# Altium schematic sheet P2.SchDoc
size A4
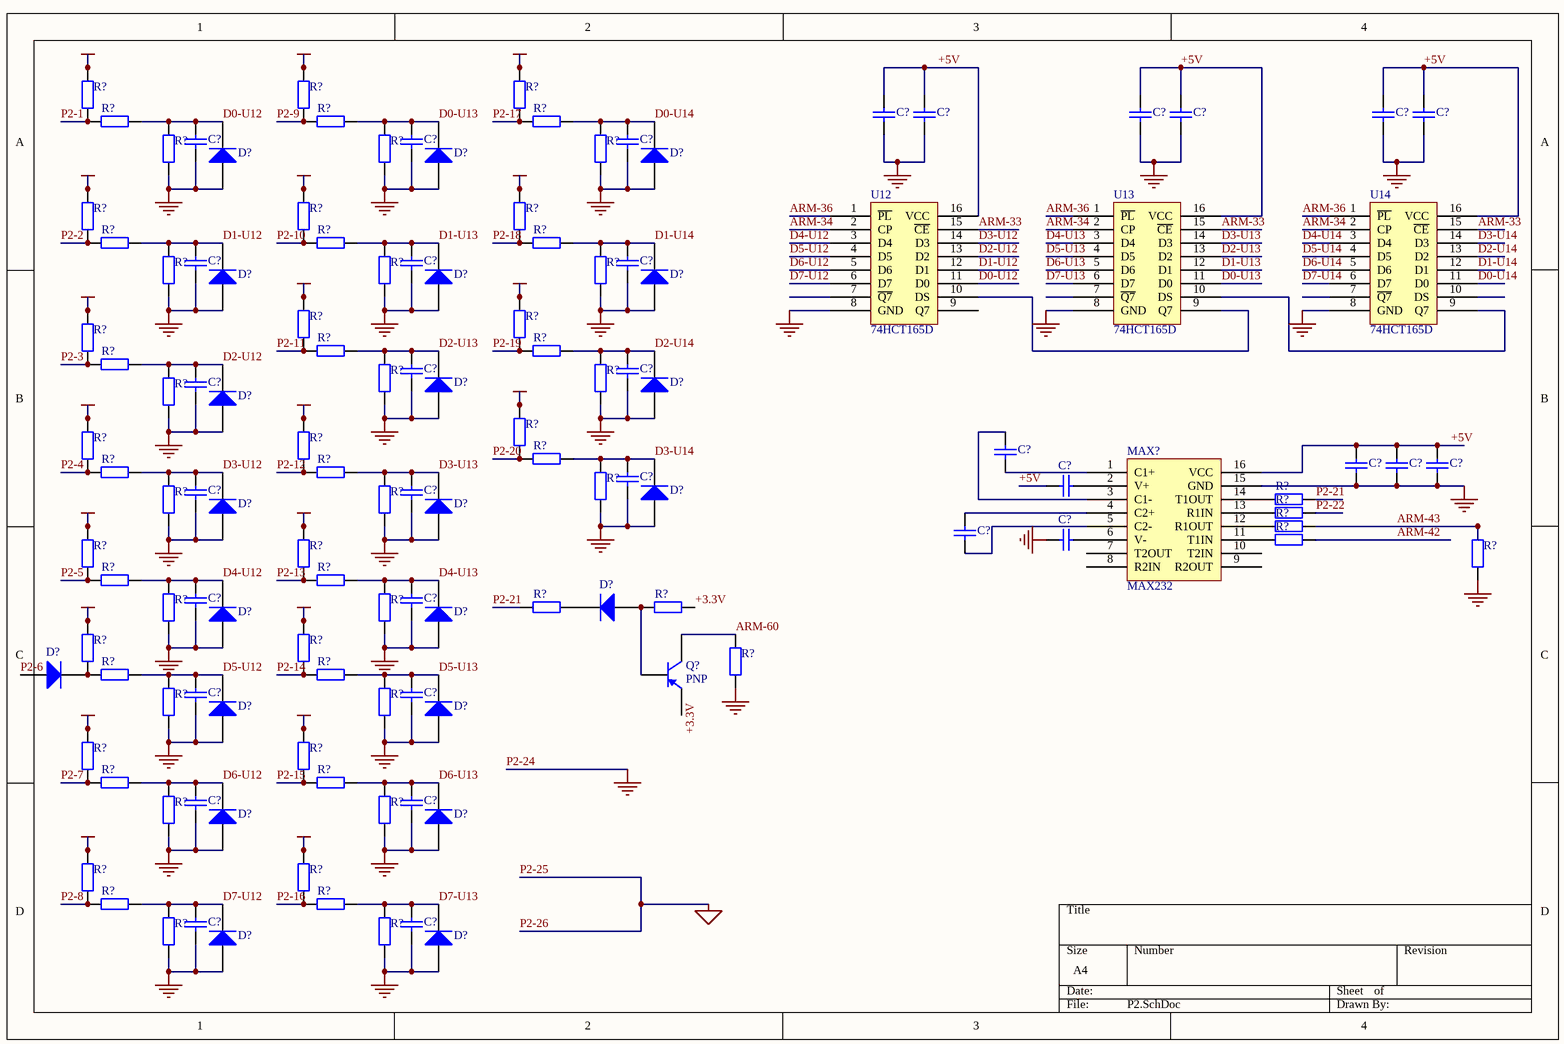
[diagram p0: P2.SchDoc]

## Parts
(Parts that share a designator on the sheet are numbered #1, #2 ... from top to bottom, then left to right.)
C?#1  Cap  [RAD-0.3]  (value not drawn)
C?#2  Cap  [RAD-0.3]  (value not drawn)
C?#3  Cap  [RAD-0.3]  (value not drawn)
C?#4  Cap  [RAD-0.3]  (value not drawn)
C?#5  Cap  [RAD-0.3]  (value not drawn)
C?#6  Cap  [RAD-0.3]  (value not drawn)
C?#7  Cap  [RAD-0.3]  (value not drawn)
C?#8  Cap  [RAD-0.3]  (value not drawn)
C?#9  Cap  [RAD-0.3]  (value not drawn)
C?#10  Cap  [RAD-0.3]  (value not drawn)
C?#11  Cap  [RAD-0.3]  (value not drawn)
C?#12  Cap  [RAD-0.3]  (value not drawn)
C?#13  Cap  [RAD-0.3]  (value not drawn)
C?#14  Cap  [RAD-0.3]  (value not drawn)
C?#15  Cap  [RAD-0.3]  (value not drawn)
C?#16  Cap  [RAD-0.3]  (value not drawn)
C?#17  Cap  [RAD-0.3]  (value not drawn)
C?#18  Cap  [RAD-0.3]  (value not drawn)
C?#19  Cap  [RAD-0.3]  (value not drawn)
C?#20  Cap  [RAD-0.3]  (value not drawn)
C?#21  Cap  [RAD-0.3]  (value not drawn)
C?#22  Cap  [RAD-0.3]  (value not drawn)
C?#23  Cap  [RAD-0.3]  (value not drawn)
C?#24  Cap  [RAD-0.3]  (value not drawn)
C?#25  Cap  [RAD-0.3]  (value not drawn)
C?#26  Cap  [RAD-0.3]  (value not drawn)
C?#27  Cap  [RAD-0.3]  (value not drawn)
C?#28  Cap  [RAD-0.3]  (value not drawn)
C?#29  Cap  [RAD-0.3]  (value not drawn)
C?#30  Cap  [RAD-0.3]  (value not drawn)
C?#31  Cap  [RAD-0.3]  (value not drawn)
C?#32  Cap  [RAD-0.3]  (value not drawn)
C?#33  Cap  [RAD-0.3]  (value not drawn)
D?#1  Diode 1N4007  [DO-41]  (value not drawn)
D?#2  Diode 1N4007  [DO-41]  (value not drawn)
D?#3  Diode 1N4007  [DO-41]  (value not drawn)
D?#4  Diode 1N4007  [DO-41]  (value not drawn)
D?#5  Diode 1N4007  [DO-41]  (value not drawn)
D?#6  Diode 1N4007  [DO-41]  (value not drawn)
D?#7  Diode 1N4007  [DO-41]  (value not drawn)
D?#8  Diode 1N4007  [DO-41]  (value not drawn)
D?#9  Diode 1N4007  [DO-41]  (value not drawn)
D?#10  Diode 1N4007  [DO-41]  (value not drawn)
D?#11  Diode 1N4007  [DO-41]  (value not drawn)
D?#12  Diode 1N4007  [DO-41]  (value not drawn)
D?#13  Diode 1N4007  [DO-41]  (value not drawn)
D?#14  Diode 1N4007  [DO-41]  (value not drawn)
D?#15  Diode 1N4007  [DO-41]  (value not drawn)
D?#16  Diode 1N4007  [DO-41]  (value not drawn)
D?#17  Diode 1N4007  [DO-41]  (value not drawn)
D?#18  Diode 1N4007  [DO-41]  (value not drawn)
D?#19  Diode 1N4007  [DO-41]  (value not drawn)
D?#20  Diode 1N4007  [DO-41]  (value not drawn)
D?#21  Diode 1N4007  [DO-41]  (value not drawn)
D?#22  Diode 1N4007  [DO-41]  (value not drawn)
MAX?  MAX232
Q?  PNP  [SOT-23B]
R?#1  Res2  [AXIAL-0.4]  (value not drawn)
R?#2  Res2  [AXIAL-0.4]  (value not drawn)
R?#3  Res2  [AXIAL-0.4]  (value not drawn)
R?#4  Res2  [AXIAL-0.4]  (value not drawn)
R?#5  Res2  [AXIAL-0.4]  (value not drawn)
R?#6  Res2  [AXIAL-0.4]  (value not drawn)
R?#7  Res2  [AXIAL-0.4]  (value not drawn)
R?#8  Res2  [AXIAL-0.4]  (value not drawn)
R?#9  Res2  [AXIAL-0.4]  (value not drawn)
R?#10  Res2  [AXIAL-0.4]  (value not drawn)
R?#11  Res2  [AXIAL-0.4]  (value not drawn)
R?#12  Res2  [AXIAL-0.4]  (value not drawn)
R?#13  Res2  [AXIAL-0.4]  (value not drawn)
R?#14  Res2  [AXIAL-0.4]  (value not drawn)
R?#15  Res2  [AXIAL-0.4]  (value not drawn)
R?#16  Res2  [AXIAL-0.4]  (value not drawn)
R?#17  Res2  [AXIAL-0.4]  (value not drawn)
R?#18  Res2  [AXIAL-0.4]  (value not drawn)
R?#19  Res2  [AXIAL-0.4]  (value not drawn)
R?#20  Res2  [AXIAL-0.4]  (value not drawn)
R?#21  Res2  [AXIAL-0.4]  (value not drawn)
R?#22  Res2  [AXIAL-0.4]  (value not drawn)
R?#23  Res2  [AXIAL-0.4]  (value not drawn)
R?#24  Res2  [AXIAL-0.4]  (value not drawn)
R?#25  Res2  [AXIAL-0.4]  (value not drawn)
R?#26  Res2  [AXIAL-0.4]  (value not drawn)
R?#27  Res2  [AXIAL-0.4]  (value not drawn)
R?#28  Res2  [AXIAL-0.4]  (value not drawn)
R?#29  Res2  [AXIAL-0.4]  (value not drawn)
R?#30  Res2  [AXIAL-0.4]  (value not drawn)
R?#31  Res2  [AXIAL-0.4]  (value not drawn)
R?#32  Res2  [AXIAL-0.4]  (value not drawn)
R?#33  Res2  [AXIAL-0.4]  (value not drawn)
R?#34  Res2  [AXIAL-0.4]  (value not drawn)
R?#35  Res2  [AXIAL-0.4]  (value not drawn)
R?#36  Res2  [AXIAL-0.4]  (value not drawn)
R?#37  Res2  [AXIAL-0.4]  (value not drawn)
R?#38  Res2  [AXIAL-0.4]  (value not drawn)
R?#39  Res2  [AXIAL-0.4]  (value not drawn)
R?#40  Res2  [AXIAL-0.4]  (value not drawn)
R?#41  Res2  [AXIAL-0.4]  (value not drawn)
R?#42  Res2  [AXIAL-0.4]  (value not drawn)
R?#43  Res2  [AXIAL-0.4]  (value not drawn)
R?#44  Res2  [AXIAL-0.4]  (value not drawn)
R?#45  Res2  [AXIAL-0.4]  (value not drawn)
R?#46  Res2  [AXIAL-0.4]  (value not drawn)
R?#47  Res2  [AXIAL-0.4]  (value not drawn)
R?#48  Res2  [AXIAL-0.4]  (value not drawn)
R?#49  Res2  [AXIAL-0.4]  (value not drawn)
R?#50  Res2  [AXIAL-0.4]  (value not drawn)
R?#51  Res2  [AXIAL-0.4]  (value not drawn)
R?#52  Res2  [AXIAL-0.4]  (value not drawn)
R?#53  Res2  [AXIAL-0.4]  (value not drawn)
R?#54  Res2  [AXIAL-0.4]  (value not drawn)
R?#55  Res2  [AXIAL-0.4]  (value not drawn)
R?#56  Res2  [AXIAL-0.4]  (value not drawn)
R?#57  Res2  [AXIAL-0.4]  (value not drawn)
R?#58  Res2  [AXIAL-0.4]  (value not drawn)
R?#59  Res2  [AXIAL-0.4]  (value not drawn)
R?#60  Res2  [AXIAL-0.4]  (value not drawn)
R?#61  Res2  [AXIAL-0.4]  (value not drawn)
R?#62  Res2  [AXIAL-0.4]  (value not drawn)
R?#63  Res2  [AXIAL-0.4]  (value not drawn)
R?#64  Res2  [AXIAL-0.4]  (value not drawn)
R?#65  Res2  [AXIAL-0.4]  (value not drawn)
R?#66  Res2  [AXIAL-0.4]  (value not drawn)
R?#67  Res2  [AXIAL-0.4]  (value not drawn)
R?#68  Res2  [AXIAL-0.4]  (value not drawn)
U12  74HCT165D
U13  74HCT165D
U14  74HCT165D

## Nets
P2-24: C?#1.1 C?#2.1 C?#3.1 C?#4.1 C?#5.1 C?#6.1 C?#7.1 C?#8.1 C?#9.1 C?#10.1 C?#11.1 C?#12.1 C?#13.1 C?#14.1 C?#15.1 C?#17.2 C?#18.2 C?#19.2 C?#20.1 C?#21.1 C?#22.1 C?#25.2 C?#26.1 C?#27.1 C?#28.1 C?#29.1 C?#30.1 C?#31.1 C?#32.1 C?#33.1 D?#1.1(A) D?#2.1(A) D?#3.1(A) D?#4.1(A) D?#5.1(A) D?#6.1(A) D?#7.1(A) D?#8.1(A) D?#9.1(A) D?#10.1(A) D?#11.1(A) D?#12.1(A) D?#13.1(A) D?#14.1(A) D?#17.1(A) D?#18.1(A) D?#19.1(A) D?#20.1(A) D?#21.1(A) D?#22.1(A) MAX?.15(GND) R?#5.2 R?#7.2 R?#9.2 R?#14.2 R?#16.2 R?#18.2 R?#23.2 R?#25.2 R?#27.2 R?#32.2 R?#34.2 R?#36.2 R?#40.2 R?#45.2 R?#47.2 R?#50.2 R?#54.2 R?#56.2 R?#60.2 R?#62.2 R?#66.2 R?#68.2 U12.8(GND) U13.8(GND) U14.8(GND)  [also labelled GND, P2-25, P2-26]
VCC: R?#1.2 R?#2.2 R?#3.2 R?#10.2 R?#11.2 R?#12.2 R?#19.2 R?#20.2 R?#21.2 R?#28.2 R?#29.2 R?#30.2 R?#42.2 R?#43.2 R?#51.2 R?#52.2 R?#57.2 R?#58.2 R?#63.2 R?#64.2
+3.3V: R?#49.1
+5V: C?#1.2 C?#2.2 C?#3.2 C?#4.2 C?#5.2 C?#6.2 C?#17.1 C?#18.1 C?#19.1 C?#23.2 MAX?.16(VCC) U12.16(VCC) U13.16(VCC) U14.16(VCC)
ARM-33: U12.15(~{CE}) U13.15(~{CE}) U14.15(~{CE})
ARM-34: U12.2(CP) U13.2(CP) U14.2(CP)
ARM-36: U12.1(~{PL}) U13.1(~{PL}) U14.1(~{PL})
ARM-42: R?#41.1
ARM-43: R?#39.1 R?#40.1
ARM-60: Q?.1(C) R?#50.1
D0-U12: C?#7.2 D?#1.2(K) R?#4.1 R?#5.1 U12.11(D0)
D0-U13: C?#8.2 D?#2.2(K) R?#6.1 R?#7.1 U13.11(D0)
D0-U14: C?#9.2 D?#3.2(K) R?#8.1 R?#9.1 U14.11(D0)
D1-U12: C?#10.2 D?#4.2(K) R?#13.1 R?#14.1 U12.12(D1)
D1-U13: C?#11.2 D?#5.2(K) R?#15.1 R?#16.1 U13.12(D1)
D1-U14: C?#12.2 D?#6.2(K) R?#17.1 R?#18.1 U14.12(D1)
D2-U12: C?#15.2 D?#9.2(K) R?#26.1 R?#27.1 U12.13(D2)
D2-U13: C?#13.2 D?#7.2(K) R?#22.1 R?#23.1 U13.13(D2)
D2-U14: C?#14.2 D?#8.2(K) R?#24.1 R?#25.1 U14.13(D2)
D3-U12: C?#21.2 D?#11.2(K) R?#33.1 R?#34.1 U12.14(D3)
D3-U13: C?#22.2 D?#12.2(K) R?#35.1 R?#36.1 U13.14(D3)
D3-U14: C?#20.2 D?#10.2(K) R?#31.1 R?#32.1 U14.14(D3)
D4-U12: C?#26.2 D?#13.2(K) R?#44.1 R?#45.1 U12.3(D4)
D4-U13: C?#27.2 D?#14.2(K) R?#46.1 R?#47.1 U13.3(D4)
D4-U14: U14.3(D4)
D5-U12: C?#28.2 D?#17.2(K) R?#53.1 R?#54.1 U12.4(D5)
D5-U13: C?#29.2 D?#18.2(K) R?#55.1 R?#56.1 U13.4(D5)
D5-U14: U14.4(D5)
D6-U12: C?#30.2 D?#19.2(K) R?#59.1 R?#60.1 U12.5(D6)
D6-U13: C?#31.2 D?#20.2(K) R?#61.1 R?#62.1 U13.5(D6)
D6-U14: U14.5(D6)
D7-U12: C?#32.2 D?#21.2(K) R?#65.1 R?#66.1 U12.6(D7)
D7-U13: C?#33.2 D?#22.2(K) R?#67.1 R?#68.1 U13.6(D7)
D7-U14: U14.6(D7)
P2-1: R?#1.1 R?#4.2
P2-2: R?#10.1 R?#13.2
P2-3: R?#21.1 R?#26.2
P2-4: R?#29.1 R?#33.2
P2-5: R?#42.1 R?#44.2
P2-6: D?#16.1(A)
P2-7: R?#57.1 R?#59.2
P2-8: R?#63.1 R?#65.2
P2-9: R?#2.1 R?#6.2
P2-10: R?#11.1 R?#15.2
P2-11: R?#19.1 R?#22.2
P2-12: R?#30.1 R?#35.2
P2-13: R?#43.1 R?#46.2
P2-14: R?#52.1 R?#55.2
P2-15: R?#58.1 R?#61.2
P2-16: R?#64.1 R?#67.2
P2-17: R?#3.1 R?#8.2
P2-18: R?#12.1 R?#17.2
P2-19: R?#20.1 R?#24.2
P2-20: R?#28.1 R?#31.2
P2-21: R?#37.1 R?#48.2
P2-22: R?#38.1
NetC?#16_1: C?#16.1 MAX?.1(C1+)
NetC?#16_2: C?#16.2 MAX?.3(C1-)
NetC?#23_1: C?#23.1 MAX?.2(V+)
NetC?#24_1: C?#24.1 MAX?.5(C2-)
NetC?#24_2: C?#24.2 MAX?.4(C2+)
NetC?#25_1: C?#25.1 MAX?.6(V-)
NetD?#15_1: D?#15.1(A) Q?.2(B) R?#49.2
NetD?#15_2: D?#15.2(K) R?#48.1
NetD?#16_2: D?#16.2(K) R?#51.1 R?#53.2
NetMAX?_11: MAX?.11(T1IN) R?#41.2
NetMAX?_12: MAX?.12(R1OUT) R?#39.2
NetMAX?_13: MAX?.13(R1IN) R?#38.2
NetMAX?_14: MAX?.14(T1OUT) R?#37.2
NetU12_10: U12.10(DS) U13.9(Q7)
NetU13_10: U13.10(DS) U14.9(Q7)

Not connected (* = marked no-connect by the designer): MAX? 7(T2OUT) 8(R2IN) 9(R2OUT) 10(T2IN); Q? 3(E); U12 7(~{Q7}) 9(Q7); U13 7(~{Q7}); U14 7(~{Q7}) 10(DS)

## Notes on the sheet
- Labels drawn without touching a wire or pin: +3.3V

## Library data of the parts
C?#1-C?#33 = Cap: Capacitor; Value: 0.01uF; Published: 8-Jun-2000; LatestRevisionDate: 17-Jul-2002; LatestRevisionNote: Re-released for DXP Platform.; PackageReference: RAD-0.3; Publisher: Altium Limited
D?#1-D?#22 = Diode 1N4007: 1 Amp General Purpose Rectifier; Published: 8-Jun-2000; LatestRevisionDate: 17-Jul-2002; LatestRevisionNote: Re-released for DXP Platform.; DatasheetDocument: 1998; PackageDocument: Aug-1999; PackageReference: DO-41; Publisher: Altium Limited; Code_JEDEC: DO-204-AL; ComponentLink1Description: Manufacturer Link; ComponentLink1URL: http://www.fairchildsemi.com/; ComponentLink2Description: Datasheet; ComponentLink2URL: http://www.fairchildsemi.com/ds/1N%2F1N4001.pdf
MAX? U12-U14 = Component_1
Q? = PNP: PNP Bipolar Transistor; Published: 8-Jun-2000; LatestRevisionDate: 17-Jul-2002; LatestRevisionNote: Re-released for DXP Platform.; PackageReference: SOT-23B; Publisher: Altium Limited; Code_JEDEC: SOT-23
R?#1-R?#68 = Res2: Resistor; Value: 1K; Published: 8-Jun-2000; LatestRevisionDate: 17-Jul-2002; LatestRevisionNote: Re-released for DXP Platform.; PackageReference: AXIAL-0.4; Publisher: Altium Limited